# Altium schematic sheet CPU.SchDoc
size A4
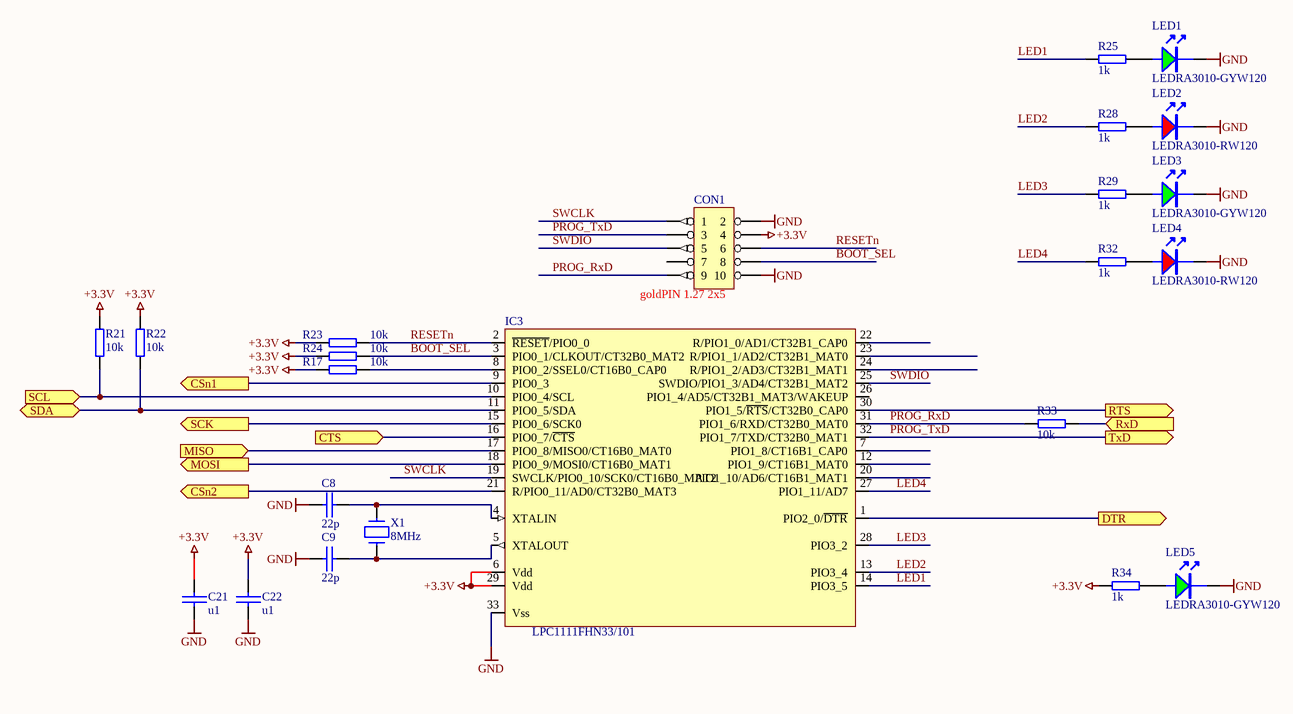
[diagram p0: CPU.SchDoc]

## Parts
C8  22p  [0603C]
C9  22p  [0603C]
C21  u1  [0603]
C22  u1  [0603]
CON1  goldPIN 1.27 2x5  [CON_2x5_MINI]
IC3  LPC1111FHN33/101  [HVQFN33_QFN127P600-8N]
LED1  LEDRA3010-GYW120  [LED_KPA3010_G]
LED2  LEDRA3010-RW120  [LED_KPA3010_R]
LED3  LEDRA3010-GYW120  [LED_KPA3010_G]
LED4  LEDRA3010-RW120  [LED_KPA3010_R]
LED5  LEDRA3010-GYW120  [LED_KPA3010_G]
R17  10k  [0603r]
R21  10k  [0603R]
R22  10k  [0603R]
R23  10k  [0603r]
R24  10k  [0603r]
R25  1k  [0603r]
R28  1k  [0603r]
R29  1k  [0603r]
R32  1k  [0603r]
R33  10k  [0603r]
R34  1k  [0603r]
X1  8MHz  [HC-49SM]

## Ports
CSn1 (out), CSn2 (out), CTS (in), DTR (out), MISO (in), MOSI (out), RTS (out), RxD (in), SCK (out), SCL (in), SDA (bidir), TxD (out)

## Nets
+3.3V: C21.1 C22.1 CON1.4 IC3.6(Vdd) IC3.29(Vdd) R17.2 R21.2 R22.2 R23.2 R24.2 R34.1
GND: C8.1 C9.1 C21.2 C22.2 CON1.2 CON1.10 IC3.33(Vss) LED1.K LED2.K LED3.K LED4.K LED5.K
BOOT_SEL: CON1.8 IC3.3(PIO0_1/CLKOUT/CT32B0_MAT2) R24.1
CSn1: IC3.9(PIO0_3) ; port CSn1
CSn2: IC3.21(R/PIO0_11/AD0/CT32B0_MAT3) ; port CSn2
CTS: IC3.16(PIO0_7/~{CTS}) ; port CTS
DTR: IC3.1(PIO2_0/~{DTR}) ; port DTR
LED1: IC3.14(PIO3_5) R25.1
LED2: IC3.13(PIO3_4) R28.1
LED3: IC3.28(PIO3_2) R29.1
LED4: IC3.27(PIO1_11/AD7) R32.1
MISO: IC3.17(PIO0_8/MISO0/CT16B0_MAT0) ; port MISO
MOSI: IC3.18(PIO0_9/MOSI0/CT16B0_MAT1) ; port MOSI
PROG_RxD: CON1.9 IC3.31(PIO1_6/RXD/CT32B0_MAT0) R33.1
PROG_TxD: CON1.3 IC3.32(PIO1_7/TXD/CT32B0_MAT1) ; port TxD
RESETn: CON1.6 IC3.2(~{RESET}/PIO0_0) R23.1
RTS: IC3.30(PIO1_5/~{RTS}/CT32B0_CAP0) ; port RTS
RxD: R33.2 ; port RxD
SCK: IC3.15(PIO0_6/SCK0) ; port SCK
SCL: IC3.10(PIO0_4/SCL) R21.1 ; port SCL
SDA: IC3.11(PIO0_5/SDA) R22.1 ; port SDA
SWCLK: CON1.1 IC3.19(SWCLK/PIO0_10/SCK0/CT16B0_MAT2)
SWDIO: CON1.5 IC3.25(SWDIO/PIO1_3/AD4/CT32B1_MAT2)
NetC8_2: C8.2 IC3.4(XTALIN) X1.2
NetC9_2: C9.2 IC3.5(XTALOUT) X1.1
NetIC3_8: IC3.8(PIO0_2/SSEL0/CT16B0_CAP0) R17.1
NetLED1_A: LED1.A R25.2
NetLED2_A: LED2.A R28.2
NetLED3_A: LED3.A R29.2
NetLED4_A: LED4.A R32.2
NetLED5_A: LED5.A R34.2

Not connected (* = marked no-connect by the designer): CON1 7; IC3 7(PIO1_8/CT16B1_CAP0) 12(PIO1_9/CT16B1_MAT0) 20(PIO1_10/AD6/CT16B1_MAT1) 22(R/PIO1_0/AD1/CT32B1_CAP0) 23(R/PIO1_1/AD2/CT32B1_MAT0) 24(R/PIO1_2/AD3/CT32B1_MAT1) 26(PIO1_4/AD5/CT32B1_MAT3/WAKEUP)

## Library data of the parts
C8 C9 = CAP_SMD_0603: Capacitor SMD
C21 C22 = CAP_SMD: Capacitor SMD
CON1 = HEADER 5X2
IC3 = UPC_LPC1111
LED1 LED3 LED5 = LED_SMD_90deg_G: LED (Maritex)
LED2 LED4 = LED_SMD_90deg_R: LED (Maritex)
R17 R23-R25 R28 R29 R32-R34 = RES_SMD: SMD Resistor
R21 R22 = RES_0603: SMD Resistor
X1 = X_CRYSTAL: Crystal oscillator